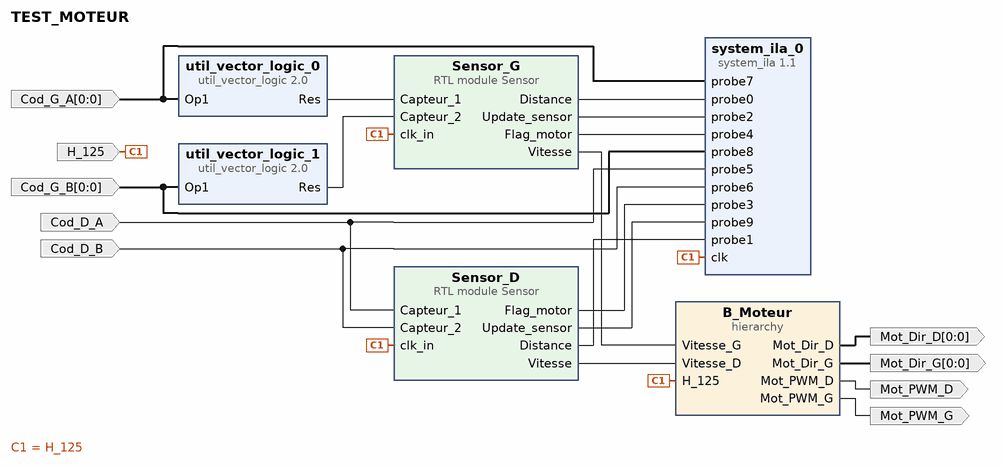
[diagram p0: block diagram of the top level]
# Vivado block design TEST_MOTEUR, xc7z020clg400-1, Vivado 2020.2
create_bd_design TEST_MOTEUR

create_bd_port -dir O Mot_PWM_D
create_bd_port -dir O -from 0 -to 0 Mot_Dir_D
create_bd_port -dir I H_125
create_bd_port -dir O -from 0 -to 0 Mot_Dir_G
create_bd_port -dir O Mot_PWM_G
create_bd_port -dir I -from 0 -to 0 Cod_G_A
create_bd_port -dir I Cod_D_A
create_bd_port -dir I Cod_D_B
create_bd_port -dir I -from 0 -to 0 Cod_G_B

create_bd_cell -type hier B_Moteur
create_bd_cell -type module -reference Sensor Sensor_G
set_property -dict {CONFIG.Dmax_size 16 CONFIG.Vmax_size 12 CONFIG.freq 150000000} [get_bd_cells Sensor_G]
create_bd_cell -type module -reference Sensor Sensor_D
set_property -dict {CONFIG.Dmax_size 16 CONFIG.Vmax_size 12 CONFIG.freq 150000000} [get_bd_cells Sensor_D]
create_bd_cell -type ip -vlnv xilinx.com:ip:util_vector_logic:2.0 util_vector_logic_0
set_property -dict {CONFIG.C_OPERATION not CONFIG.C_SIZE 1} [get_bd_cells util_vector_logic_0]
create_bd_cell -type ip -vlnv xilinx.com:ip:util_vector_logic:2.0 util_vector_logic_1
set_property -dict {CONFIG.C_OPERATION not CONFIG.C_SIZE 1} [get_bd_cells util_vector_logic_1]
create_bd_cell -type ip -vlnv xilinx.com:ip:system_ila:1.1 system_ila_0
set_property -dict [list \
  CONFIG.C_MON_TYPE NATIVE \
  CONFIG.C_NUM_OF_PROBES 10 \
  CONFIG.C_SLOT_0_INTF_TYPE xilinx.com:display_cmac_usplus:statistics_ports:2.0 \
] [get_bd_cells system_ila_0]

# ---- hierarchy /B_Moteur ----
current_bd_instance /B_Moteur
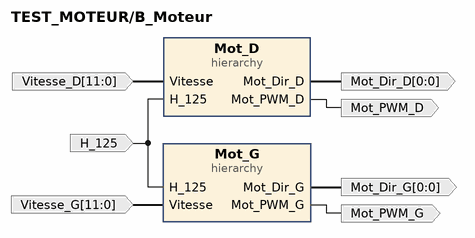
[diagram p1: block diagram inside /B_Moteur]
create_bd_pin -dir O -from 0 -to 0 Mot_Dir_D
create_bd_pin -dir O Mot_PWM_D
create_bd_pin -dir I H_125
create_bd_pin -dir O -from 0 -to 0 Mot_Dir_G
create_bd_pin -dir O Mot_PWM_G
create_bd_pin -dir I -from 11 -to 0 Vitesse_D
create_bd_pin -dir I -from 11 -to 0 Vitesse_G

create_bd_cell -type hier Mot_D
create_bd_cell -type hier Mot_G

# ---- hierarchy /B_Moteur/Mot_D ----
current_bd_instance /B_Moteur/Mot_D
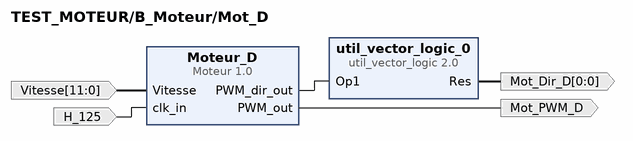
[diagram p2: block diagram inside /B_Moteur/Mot_D]
create_bd_pin -dir I -from 11 -to 0 Vitesse
create_bd_pin -dir O Mot_PWM_D
create_bd_pin -dir I H_125
create_bd_pin -dir O -from 0 -to 0 Mot_Dir_D

create_bd_cell -type ip -vlnv xilinx.com:ip:util_vector_logic:2.0 util_vector_logic_0
set_property -dict {CONFIG.C_OPERATION not CONFIG.C_SIZE 1} [get_bd_cells util_vector_logic_0]
create_bd_cell -type ip -vlnv u-ga.fr:user:Moteur:1.0 Moteur_D
set_property -dict {CONFIG.Dmax_size 12 CONFIG.Vmax_size 12 CONFIG.divider_freq 2500} [get_bd_cells Moteur_D]

# ---- hierarchy /B_Moteur/Mot_G ----
current_bd_instance /B_Moteur/Mot_G
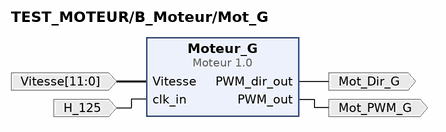
[diagram p3: block diagram inside /B_Moteur/Mot_G]
create_bd_pin -dir I -from 11 -to 0 Vitesse
create_bd_pin -dir O Mot_Dir_G
create_bd_pin -dir O Mot_PWM_G
create_bd_pin -dir I H_125

create_bd_cell -type ip -vlnv u-ga.fr:user:Moteur:1.0 Moteur_G
set_property -dict {CONFIG.Dmax_size 12 CONFIG.Vmax_size 12 CONFIG.divider_freq 2500} [get_bd_cells Moteur_G]

# ---- connections ----

current_bd_instance /B_Moteur
connect_bd_net -net H_125_1 [get_bd_pins H_125] [get_bd_pins Mot_D/H_125] [get_bd_pins Mot_G/H_125]
connect_bd_net -net Moteur_1_PWM_out [get_bd_pins Mot_G/Mot_PWM_G] [get_bd_pins Mot_PWM_G]
connect_bd_net -net Moteur_0_PWM_out [get_bd_pins Mot_D/Mot_PWM_D] [get_bd_pins Mot_PWM_D]
connect_bd_net -net Moteur_1_PWM_dir_out [get_bd_pins Mot_G/Mot_Dir_G] [get_bd_pins Mot_Dir_G]
connect_bd_net -net util_vector_logic_0_Res [get_bd_pins Mot_D/Mot_Dir_D] [get_bd_pins Mot_Dir_D]
connect_bd_net -net Vitesse_1 [get_bd_pins Vitesse_D] [get_bd_pins Mot_D/Vitesse]
connect_bd_net -net Vitesse_3 [get_bd_pins Vitesse_G] [get_bd_pins Mot_G/Vitesse]

current_bd_instance /B_Moteur/Mot_D
connect_bd_net -net Moteur_0_PWM_dir_out [get_bd_pins Moteur_D/PWM_dir_out] [get_bd_pins util_vector_logic_0/Op1]
connect_bd_net -net xlconstant_0_dout [get_bd_pins Vitesse] [get_bd_pins Moteur_D/Vitesse]
connect_bd_net -net Moteur_0_PWM_out [get_bd_pins Moteur_D/PWM_out] [get_bd_pins Mot_PWM_D]
connect_bd_net -net H_125_1 [get_bd_pins H_125] [get_bd_pins Moteur_D/clk_in]
connect_bd_net [get_bd_pins util_vector_logic_0/Res] [get_bd_pins Mot_Dir_D]

current_bd_instance /B_Moteur/Mot_G
connect_bd_net -net xlconstant_1_dout [get_bd_pins Vitesse] [get_bd_pins Moteur_G/Vitesse]
connect_bd_net -net Moteur_1_PWM_dir_out [get_bd_pins Moteur_G/PWM_dir_out] [get_bd_pins Mot_Dir_G]
connect_bd_net -net Moteur_1_PWM_out [get_bd_pins Moteur_G/PWM_out] [get_bd_pins Mot_PWM_G]
connect_bd_net -net H_125_1 [get_bd_pins H_125] [get_bd_pins Moteur_G/clk_in]

current_bd_instance /
connect_bd_net -net Moteur_0_PWM_out [get_bd_pins B_Moteur/Mot_PWM_D] [get_bd_ports Mot_PWM_D]
connect_bd_net -net Moteur_0_PWM_dir_out [get_bd_pins B_Moteur/Mot_Dir_D] [get_bd_ports Mot_Dir_D]
connect_bd_net -net H_125_1 [get_bd_ports H_125] \
  [get_bd_pins B_Moteur/H_125] [get_bd_pins Sensor_D/clk_in] [get_bd_pins Sensor_G/clk_in] [get_bd_pins system_ila_0/clk]
connect_bd_net -net Moteur_1_PWM_dir_out [get_bd_pins B_Moteur/Mot_Dir_G] [get_bd_ports Mot_Dir_G]
connect_bd_net -net Moteur_1_PWM_out [get_bd_pins B_Moteur/Mot_PWM_G] [get_bd_ports Mot_PWM_G]
connect_bd_net [get_bd_pins Sensor_D/Vitesse] [get_bd_pins B_Moteur/Vitesse_D]
connect_bd_net [get_bd_pins Sensor_G/Vitesse] [get_bd_pins B_Moteur/Vitesse_G]
connect_bd_net [get_bd_pins util_vector_logic_0/Res] [get_bd_pins Sensor_G/Capteur_1]
connect_bd_net [get_bd_pins util_vector_logic_1/Res] [get_bd_pins Sensor_G/Capteur_2]
connect_bd_net -net Op1_0_1 [get_bd_ports Cod_G_A] [get_bd_pins util_vector_logic_0/Op1] [get_bd_pins system_ila_0/probe7]
connect_bd_net -net Capteur_1_0_1 [get_bd_ports Cod_D_A] [get_bd_pins Sensor_D/Capteur_1] [get_bd_pins system_ila_0/probe5]
connect_bd_net -net Op1_1_1 [get_bd_ports Cod_G_B] [get_bd_pins util_vector_logic_1/Op1] [get_bd_pins system_ila_0/probe8]
connect_bd_net [get_bd_pins Sensor_G/Distance] [get_bd_pins system_ila_0/probe0]
connect_bd_net [get_bd_pins Sensor_G/Update_sensor] [get_bd_pins system_ila_0/probe2]
connect_bd_net [get_bd_pins Sensor_D/Flag_motor] [get_bd_pins system_ila_0/probe3]
connect_bd_net [get_bd_pins Sensor_G/Flag_motor] [get_bd_pins system_ila_0/probe4]
connect_bd_net [get_bd_ports Cod_D_B] [get_bd_pins Sensor_D/Capteur_2] [get_bd_pins system_ila_0/probe6]
connect_bd_net [get_bd_pins Sensor_D/Update_sensor] [get_bd_pins system_ila_0/probe9]
connect_bd_net [get_bd_pins Sensor_D/Distance] [get_bd_pins system_ila_0/probe1]

validate_bd_design
save_bd_design
